# EAGLE schematic damp2_v0001 (EAGLE 6.4)

## Sheet 1 of 3: USB to I2S
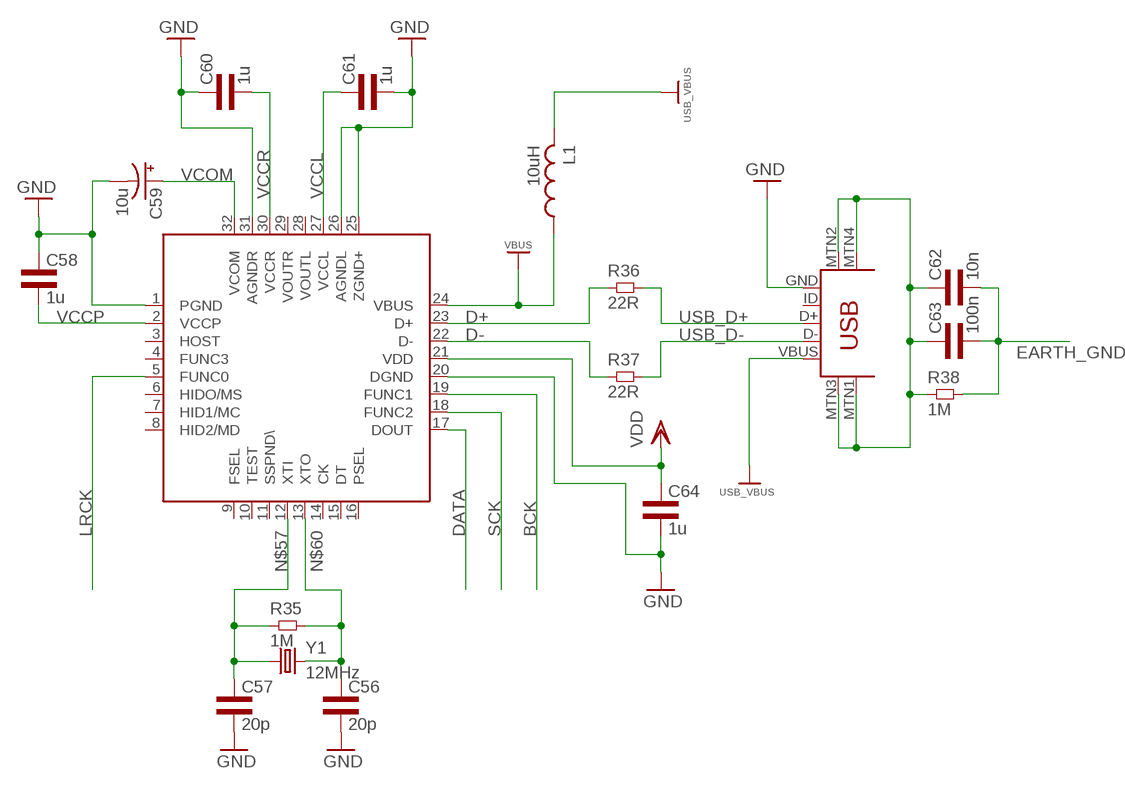
[diagram p0: schematic, sheet 1]

### Parts
C56  20p  CAP0603L3  [0603L3]
C57  20p  CAP0603L3  [0603L3]
C58  1u  CAP0603L3  [0603L3]
C59  10u  CPOL-USE1.8-4  [E1,8-4]
C60  1u  CAP0603L3  [0603L3]
C61  1u  CAP0603L3  [0603L3]
C62  10n  CAP0603L3  [0603L3]
C63  100n  CAP0603L3  [0603L3]
C64  1u  CAP0603L3  [0603L3]
L1  10uH  L-USL3225M  [L3225M]
R35  1M  RES0603L3  [0603L3]
R36  22R  RES0603L3  [0603L3]
R37  22R  RES0603L3  [0603L3]
R38  1M  RES0603L3  [0603L3]
U$1  PCM2707_V1_PCM2704C_PCM2707  [PCM2707_V1_PCM2704C_PCM2707]
U$9  USB-MINIB-5PIN  [USB-MINIB]
Y1  12MHz  CRYSTALHC49US  [HC49US]

### Nets
BCK: U$1.19(FUNC1) ; also sheet 2
D+: R36.P$1 U$1.23(D+)
D-: R37.P$1 U$1.22(D-)
DATA: U$1.17(DOUT) ; also sheet 2
EARTH_GND: C62.P$2 C63.P$2 R38.P$2
GND: C56.P$2 C57.P$2 C58.P$1 C59.- C60.P$1 C61.P$2 C64.P$2 U$1.1(PGND) U$1.20(DGND) U$1.25(ZGND+) U$1.26(AGNDL) U$1.31(AGNDR) U$9.GND ; also sheet 2,3
LRCK: U$1.5(FUNC0) ; also sheet 2
N$57: C57.P$1 R35.P$1 U$1.12(XTI) Y1.1
N$60: C56.P$1 R35.P$2 U$1.13(XTO) Y1.2
N$63: C62.P$1 C63.P$1 R38.P$1 U$9.MTN1(MTN2) U$9.MTN2(MTN3) U$9.MTN3(MTN1) U$9.MTN4
SCK: U$1.18(FUNC2) ; also sheet 2
USB_D+: R36.P$2 U$9.D+
USB_D-: R37.P$2 U$9.D-
USB_VBUS: L1.2 U$9.VBUS
VBUS: L1.1 U$1.24(VBUS)
VCCL: C61.P$1 U$1.27(VCCL)
VCCP: C58.P$2 U$1.2(VCCP)
VCCR: C60.P$2 U$1.30(VCCR)
VCOM: C59.+ U$1.32(VCOM)
VDD: C64.P$1 U$1.21(VDD)
Unconnected: U$1.3(HOST) U$1.4(FUNC3) U$1.6(HIDO/MS) U$1.7(HID1/MC) U$1.8(HID2/MD) U$1.9(FSEL) U$1.10(TEST) U$1.11(SSPND\) U$1.14(CK) U$1.15(DT) U$1.16(PSEL) U$1.28(VOUTL) U$1.29(VOUTR) U$9.ID

## Sheet 2 of 3: DAC
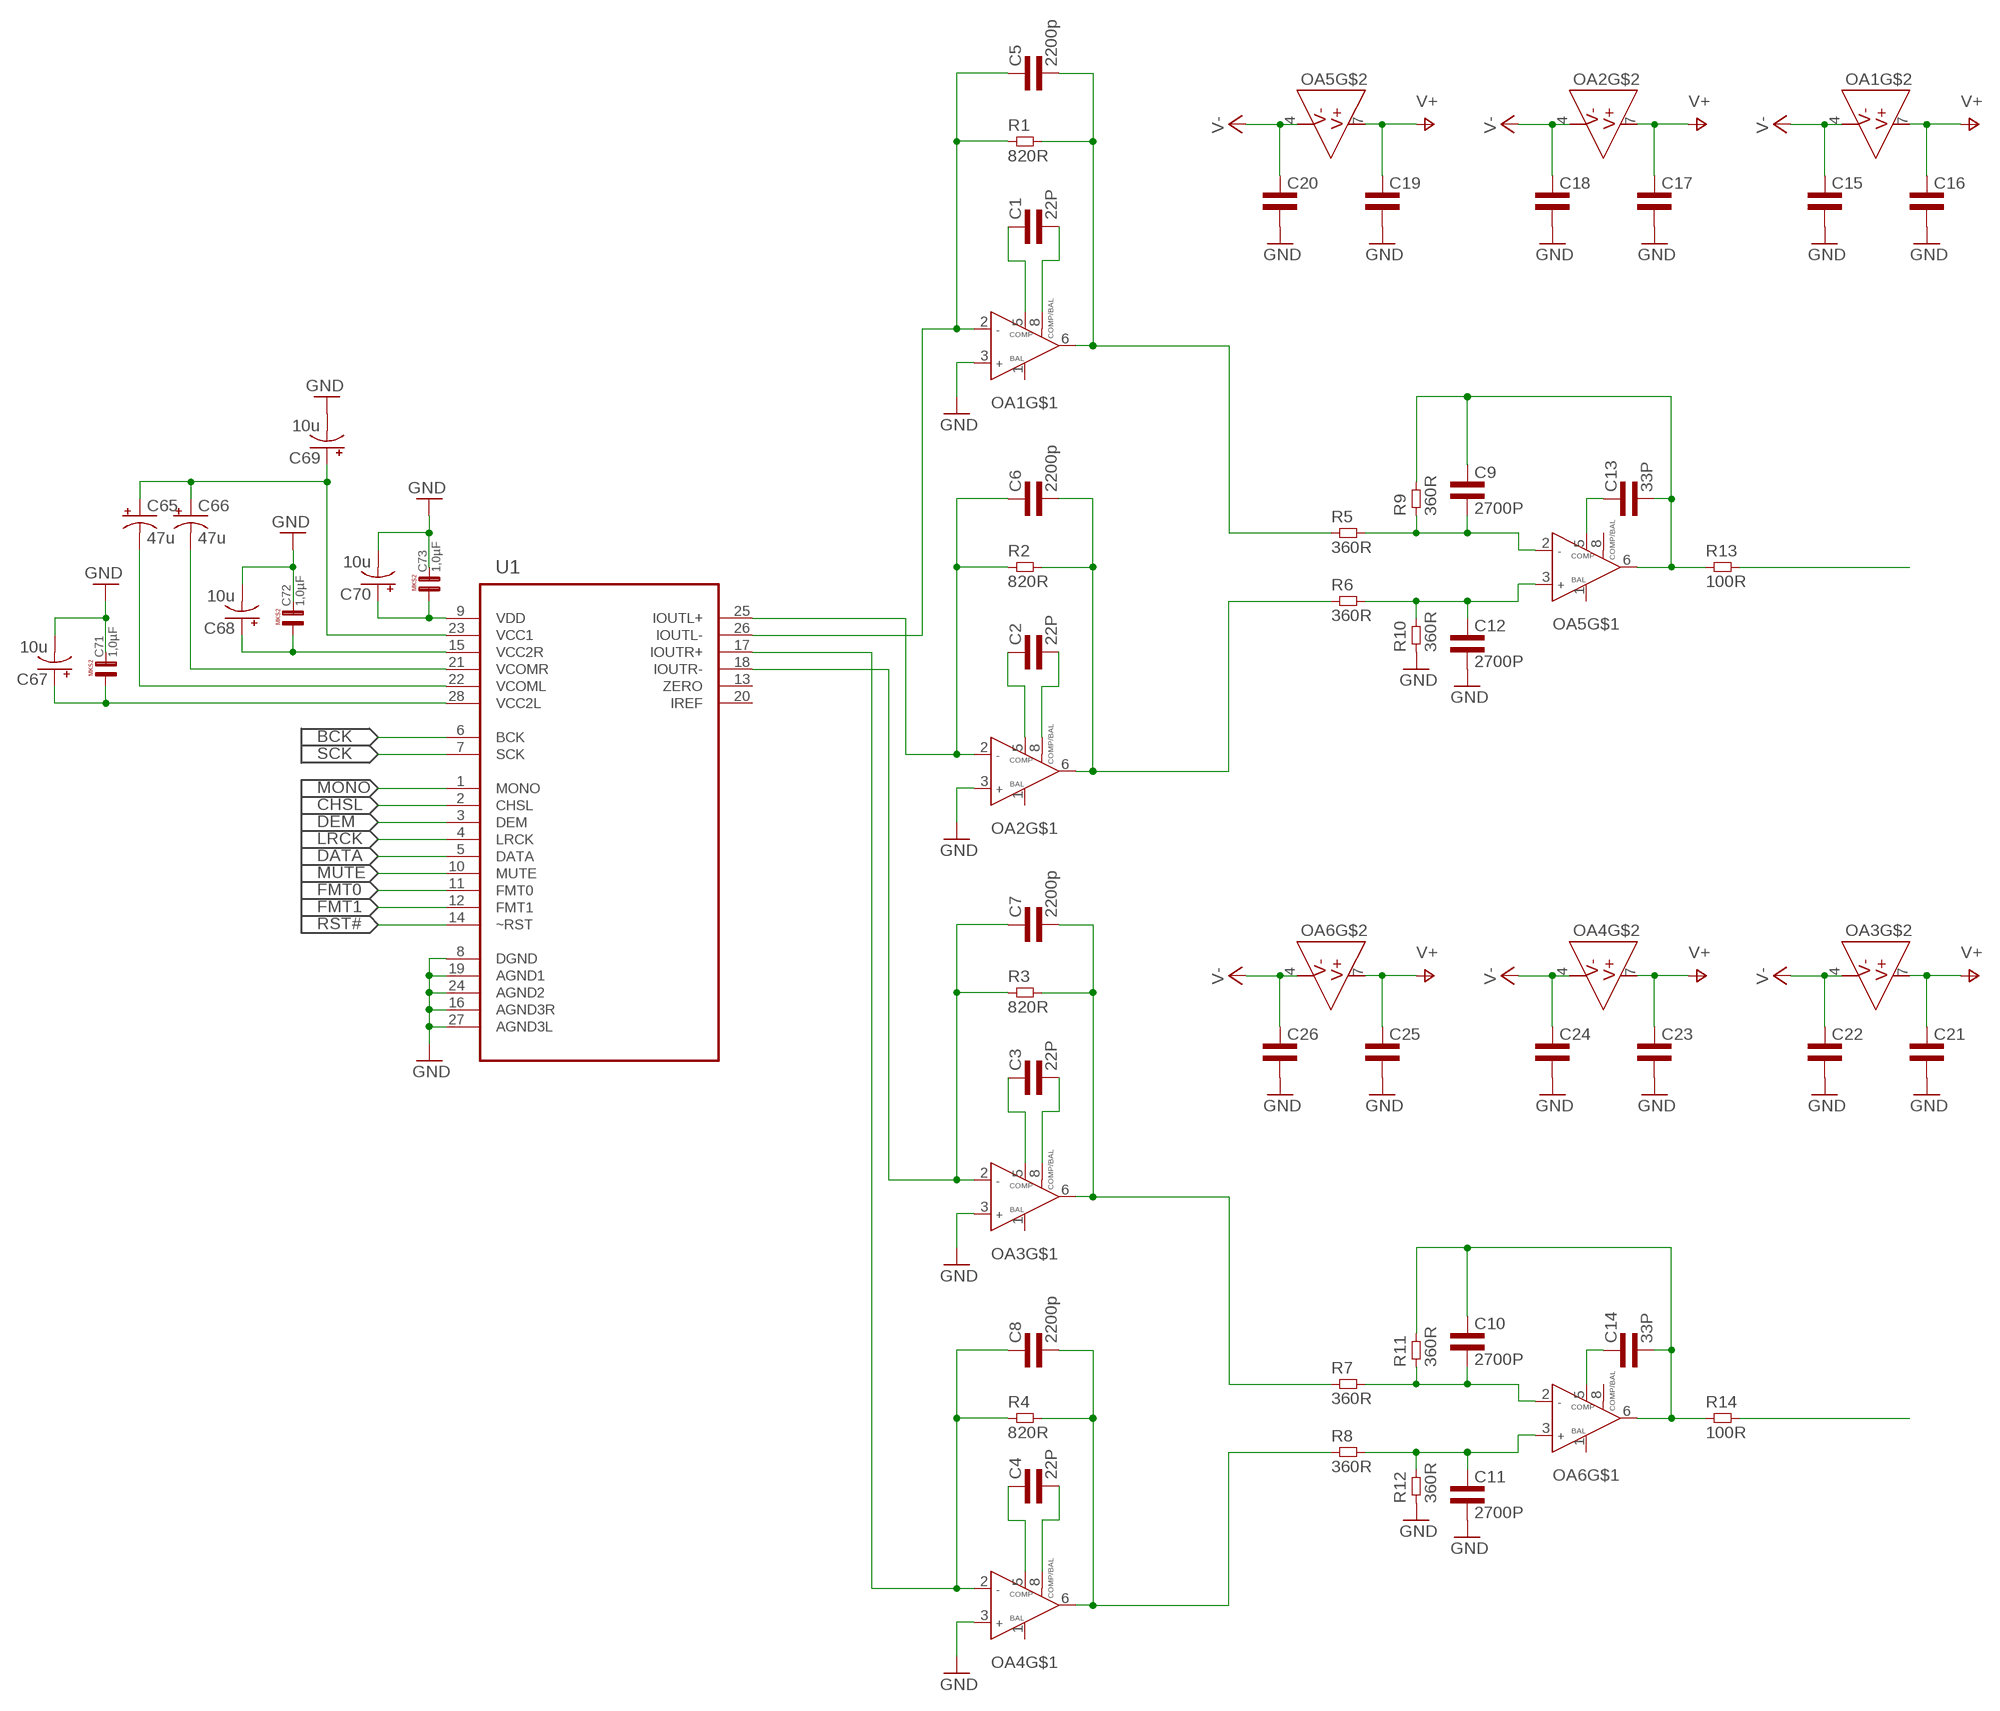
[diagram p1: schematic, sheet 2]

### Parts
C1  22P  CAP0603L3  [0603L3]
C2  22P  CAP0603L3  [0603L3]
C3  22P  CAP0603L3  [0603L3]
C4  22P  CAP0603L3  [0603L3]
C5  2200p  CAP0603L3  [0603L3]
C6  2200p  CAP0603L3  [0603L3]
C7  2200p  CAP0603L3  [0603L3]
C8  2200p  CAP0603L3  [0603L3]
C9  2700P  CAP0805L3  [0805L3]
C10  2700P  CAP0805L3  [0805L3]
C11  2700P  CAP0805L3  [0805L3]
C12  2700P  CAP0805L3  [0805L3]
C13  33P  CAP0603L3  [0603L3]
C14  33P  CAP0603L3  [0603L3]
C15  CAP0603L3  [0603L3]
C16  CAP0603L3  [0603L3]
C17  CAP0603L3  [0603L3]
C18  CAP0603L3  [0603L3]
C19  CAP0603L3  [0603L3]
C20  CAP0603L3  [0603L3]
C21  CAP0603L3  [0603L3]
C22  CAP0603L3  [0603L3]
C23  CAP0603L3  [0603L3]
C24  CAP0603L3  [0603L3]
C25  CAP0603L3  [0603L3]
C26  CAP0603L3  [0603L3]
C65  47u  CPOL-USA/3216-18W  [A/3216-18W]
C66  47u  CPOL-USA/3216-18W  [A/3216-18W]
C67  10u  CPOL-USA/3216-18W  [A/3216-18W]
C68  10u  CPOL-USA/3216-18W  [A/3216-18W]
C69  10u  CPOL-USA/3216-18W  [A/3216-18W]
C70  10u  CPOL-USA/3216-18W  [A/3216-18W]
C71  1,0µF  [R5B5]
C72  1,0µF  [R5B5]
C73  1,0µF  [R5B5]
OA1  NE5534DSOIC8  [SOIC-8]
OA2  NE5534DSOIC8  [SOIC-8]
OA3  NE5534DSOIC8  [SOIC-8]
OA4  NE5534DSOIC8  [SOIC-8]
OA5  NE5534ADSOIC8  [SOIC-8]
OA6  NE5534ADSOIC8  [SOIC-8]
R1  820R  RES0603L3  [0603L3]
R2  820R  RES0603L3  [0603L3]
R3  820R  RES0603L3  [0603L3]
R4  820R  RES0603L3  [0603L3]
R5  360R  RES0805L3  [0805L3]
R6  360R  RES0805L3  [0805L3]
R7  360R  RES0805L3  [0805L3]
R8  360R  RES0805L3  [0805L3]
R9  360R  RES0805L3  [0805L3]
R10  360R  RES0805L3  [0805L3]
R11  360R  RES0805L3  [0805L3]
R12  360R  RES0805L3  [0805L3]
R13  100R  RES0805L3  [0805L3]
R14  100R  RES0805L3  [0805L3]
U1  TEXAS-INSTRUMENTS_BY_ELEMENT14_BATCH_1_PCM1794ADB  [TEXAS-INSTRUMENTS_BY_ELEMENT14_BATCH_1_SOP65P780X200-28N]

### Nets
BCK: U1.6(BCK) ; also sheet 1
CHSL: U1.2(CHSL)
DATA: U1.5(DATA) ; also sheet 1
DEM: U1.3(DEM)
FMT0: U1.11(FMT0)
FMT1: U1.12(FMT1)
GND: C11.2 C12.2 C15.P$2 C16.P$2 C17.P$2 C18.P$2 C19.P$2 C20.P$2 C21.P$2 C22.P$2 C23.P$2 C24.P$2 C25.P$2 C26.P$2 C67.- C68.- C69.- C70.- C71.2 C72.2 C73.2 OA1.3(IN+) OA2.3(IN+) OA3.3(IN+) OA4.3(IN+) R10.1 R12.1 U1.8(DGND) U1.16(AGND3R) U1.19(AGND1) U1.24(AGND2) U1.27(AGND3L) ; also sheet 1,3
LRCK: U1.4(LRCK) ; also sheet 1
MONO: U1.1(MONO)
MUTE: U1.10(MUTE)
N$1: C1.P$1 OA1.5(COMP)
N$2: C1.P$2 OA1.8(COMP/BAL)
N$3: C2.P$1 OA2.5(COMP)
N$4: C2.P$2 OA2.8(COMP/BAL)
N$5: C3.P$1 OA3.5(COMP)
N$6: C3.P$2 OA3.8(COMP/BAL)
N$7: C4.P$1 OA4.5(COMP)
N$8: C4.P$2 OA4.8(COMP/BAL)
N$9: C5.P$1 OA1.2(IN-) R1.P$1 U1.26(IOUTL-)
N$10: C6.P$1 OA2.2(IN-) R2.P$1 U1.25(IOUTL+)
N$11: C7.P$1 OA3.2(IN-) R3.P$1 U1.18(IOUTR-)
N$12: C8.P$1 OA4.2(IN-) R4.P$1 U1.17(IOUTR+)
N$13: C6.P$2 OA2.6(OUT) R2.P$2 R6.1
N$14: C5.P$2 OA1.6(OUT) R1.P$2 R5.1
N$15: C7.P$2 OA3.6(OUT) R3.P$2 R7.1
N$16: C8.P$2 OA4.6(OUT) R4.P$2 R8.1
N$17: C10.2 OA6.2(IN-) R7.2 R11.1
N$18: C11.1 OA6.3(IN+) R8.2 R12.2
N$19: C9.2 OA5.2(IN-) R5.2 R9.1
N$20: C12.1 OA5.3(IN+) R6.2 R10.2
N$21: C13.P$1 OA5.5(COMP)
N$22: C14.P$1 OA6.5(COMP)
N$23: C10.1 C14.P$2 OA6.6(OUT) R11.2 R14.1
N$24: C9.1 C13.P$2 OA5.6(OUT) R9.2 R13.1
N$37: R14.2
N$38: R13.2
N$61: C70.+ C73.1 U1.9(VDD)
N$68: C65.+ C66.+ C69.+ U1.23(VCC1)
N$69: C68.+ C72.1 U1.15(VCC2R)
N$70: C66.- U1.21(VCOMR)
N$71: C65.- U1.22(VCOML)
N$72: C67.+ C71.1 U1.28(VCC2L)
RST#: U1.14(~RST)
SCK: U1.7(SCK) ; also sheet 1
V+: C16.P$1 C17.P$1 C19.P$1 C21.P$1 C23.P$1 C25.P$1 OA1.7(V+) OA2.7(V+) OA3.7(V+) OA4.7(V+) OA5.7(V+) OA6.7(V+) ; also sheet 3
V-: C15.P$1 C18.P$1 C20.P$1 C22.P$1 C24.P$1 C26.P$1 OA1.4(V-) OA2.4(V-) OA3.4(V-) OA4.4(V-) OA5.4(V-) OA6.4(V-) ; also sheet 3
Unconnected: OA1.1(BAL) OA2.1(BAL) OA3.1(BAL) OA4.1(BAL) OA5.1(BAL) OA5.8(COMP/BAL) OA6.1(BAL) OA6.8(COMP/BAL) U1.13(ZERO) U1.20(IREF)

## Sheet 3 of 3: Amp
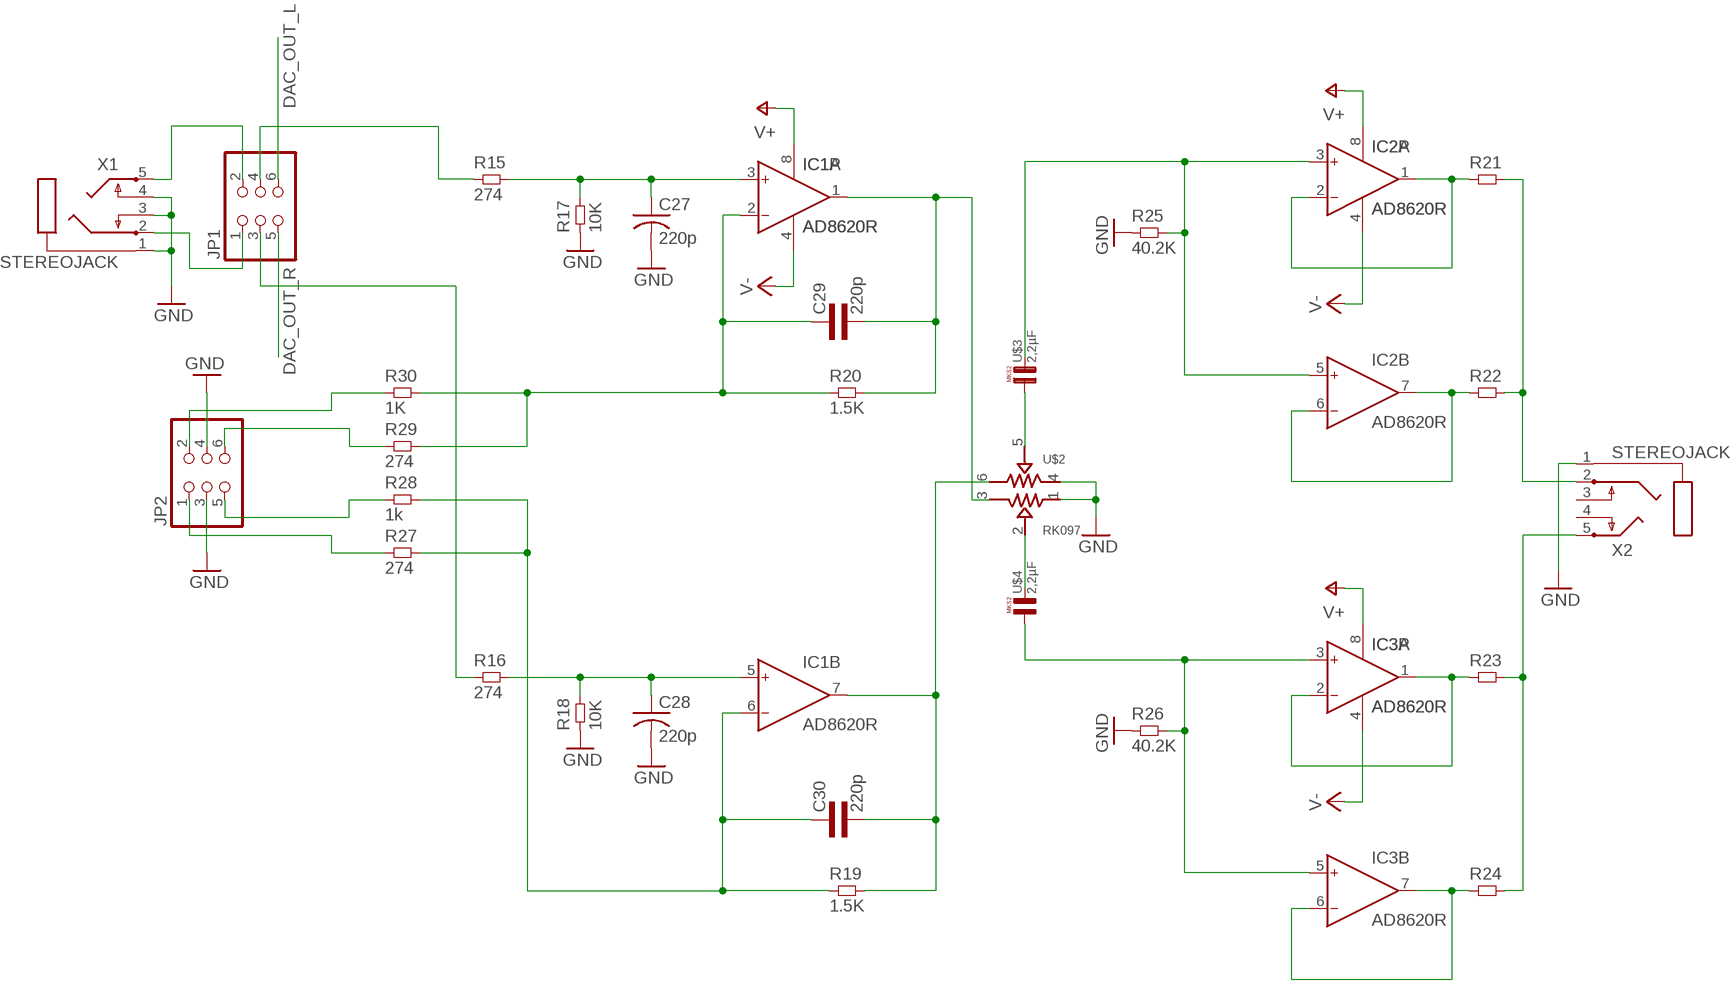
[diagram p2: schematic, sheet 3]

### Parts
C27  220p  C-US025-025X050  [C025-025X050]
C28  220p  C-US025-025X050  [C025-025X050]
C29  220p  CAP0805L3  [0805L3]
C30  220p  CAP0805L3  [0805L3]
IC1  AD8620R  [SO8]
IC2  AD8620R  [SO8]
IC3  AD8620R  [SO8]
JP1  PINHD-2X3  [2X03]
JP2  PINHD-2X3  [2X03]
R15  274  RES0805L3  [0805L3]
R16  274  RES0805L3  [0805L3]
R17  10K  RES0805L3  [0805L3]
R18  10K  RES0805L3  [0805L3]
R19  1.5K  RES0805L3  [0805L3]
R20  1.5K  RES0805L3  [0805L3]
R21  RES1206L3  [1206L3]
R22  RES1206L3  [1206L3]
R23  RES1206L3  [1206L3]
R24  RES1206L3  [1206L3]
R25  40.2K  RES0805L3  [0805L3]
R26  40.2K  RES0805L3  [0805L3]
R27  274  RES0805L3  [0805L3]
R28  1k  RES0805L3  [0805L3]
R29  274  RES0805L3  [0805L3]
R30  1K  RES0805L3  [0805L3]
U$2  RK097  [RK097]
U$3  2,2µF  [R5B7K2]
U$4  2,2µF  [R5B7K2]
X1  STEREOJACK  [STX3100]
X2  STEREOJACK  [STX3100]

### Nets
A_IN_L: JP1.2 X1.5
A_IN_R: JP1.1 X1.2
AMP_IN_L: JP1.4 R15.1
AMP_IN_R: JP1.3 R16.1
DAC_OUT_L: JP1.6
DAC_OUT_R: JP1.5
GND: C27.2 C28.2 JP2.3 JP2.4 R17.1 R18.1 R25.1 R26.1 U$2.1 U$2.4 X1.1 X1.3 X1.4 X2.1 ; also sheet 1,2
N$25: C27.1 IC1.3(A:IN+) R15.2 R17.2
N$26: C28.1 IC1.5(B:IN+) R16.2 R18.2
N$27: C29.2 IC1.1(A:OUT) R20.2 U$2.3
N$28: C30.2 IC1.7(B:OUT) R19.2 U$2.6
N$29: C30.1 IC1.6(B:IN-) R19.1 R27.2 R28.2
N$30: C29.1 IC1.2(A:IN-) R20.1 R29.2 R30.2
N$34: U$2.2 U$4.2
N$35: IC2.1(A:OUT) IC2.2(A:IN-) R21.1
N$36: IC2.6(B:IN-) IC2.7(B:OUT) R22.1
N$39: IC3.1(A:OUT) IC3.2(A:IN-) R23.1
N$40: IC3.6(B:IN-) IC3.7(B:OUT) R24.1
N$41: R21.2 R22.2 X2.2
N$42: R23.2 R24.2 X2.5
N$43: U$2.5 U$3.1
N$44: IC3.3(A:IN+) IC3.5(B:IN+) R26.2 U$4.1
N$45: IC2.3(A:IN+) IC2.5(B:IN+) R25.2 U$3.2
N$52: JP2.2 R30.1
N$53: JP2.1 R27.1
N$54: JP2.5 R28.1
N$55: JP2.6 R29.1
V+: IC1.8(P:V+) IC2.8(P:V+) IC3.8(P:V+) ; also sheet 2
V-: IC1.4(P:V-) IC2.4(P:V-) IC3.4(P:V-) ; also sheet 2
Unconnected: X2.3 X2.4

## Library data of the parts
C1-C26 C29 C30 C56-C58 C60-C64 = common:CAP
C27 C28 = rcl:C-US: CAPACITOR, American symbol
C59 C65-C70 = rcl:CPOL-US: POLARIZED CAPACITOR, American symbol
C71-C73 = Capacitor-Wima-MKS2-63v:1,0µF
IC1-IC3 = analog-devices:AD8620: Precision, Very Low Noise, Low Input Bias Current, Wide Bandwidth JFET Operational Amplifiers Source: http://www.analog.com/static/imported-files/data_sheets/AD8610_8620.pdf; MF: ALTERA CORPORATION; MPN: AD8620ARZ; OC_FARNELL: 9994386; OC_NEWARK: 59K6972
JP1 JP2 = pinhead:PINHD-2X3: PIN HEADER
L1 = rcl:L-US: INDUCTOR, American symbol
OA1-OA4 = common:NE5534: Low-noise, high-SP audio Op Amp.; BIAS_CURRENT: 1.5uA; CMRR: 100dB; GAIN_BANDWIDTH_PRODUCT: 10MHz; IN-VOL_NOISE_DENSITY: 3.5nV; OFFSET_VOL: 4mV; OUTPUT_CURRENT: 38mA; SLEW_RATE: 13V/uS; SUPPLY_CURRENT: 4mA; SUPPLY_VOL_MAX: 30V; SUPPLY_VOL_MIN: 10V
OA5 OA6 = common:NE5534: Low-noise, high-SP audio Op Amp.; BIAS_CURRENT: 500nA; CMRR: 100dB; GAIN_BANDWIDTH_PRODUCT: 10MHz; IN-VOL_NOISE_DENSITY: 3.5nV; OFFSET_VOL: 500uV; OUTPUT_CURRENT: 38mA; SLEW_RATE: 13V/uS; SUPPLY_CURRENT: 4mA; SUPPLY_VOL_MAX: 30V; SUPPLY_VOL_MIN: 10V
R1-R30 R35-R38 = common:RES
U1 = monster_dac:TEXAS-INSTRUMENTS_BY_ELEMENT14_BATCH_1_PCM1794ADB: 24-Bit 192khz Sampling advanced segment Audio stereo digital-to-analog converter; MPN: PCM1794ADB; OC_FARNELL: 1755014; OC_NEWARK: 54K0199; PACKAGE: SSOP-28; SUPPLIER: Texas Instruments
U$1 = my_dac_amp:PCM2707_V1_PCM2704C_PCM2707: Upgraded version of the PCM2704. It allows connecting to a device with USB and transmitting that data to another DAC using I2S protocol. Also has other advanced features that allow control with SPI, external buttons, etc.
U$2 = SparkFun-Electromechanical:RK097
U$3 U$4 = Capacitor-Wima-MKS2-63v:2,2µF
U$9 = SparkFun-Connectors:USB-MINIB: Mini-USB "B" connector with 5th pin broken out. Created new symbol breaking out 5th "ID" pin in mini/micro USB connector spec. See: http://en.wikipedia.org/wiki/Mini_usb#Cables. Uses same footprint as 4-pin symbol. Also added pins to connect to mounting / shield pads if required (probably not generally needed as signals aren't shielded once they leave the connector).
X1 X2 = adafruit:STEREOJACK: MIC/HEADPHONE JACK Stereo jack with two switches. Kycon STX3100, CUI SJ1-3555NG and/or 4UCon 05544
Y1 = SparkFun-FreqCtrl:CRYSTAL: Various standard crystals. Proven footprints. Spark Fun Electronics SKU : COM-00534